# Altium schematic sheet Connectors.SchDoc
size A
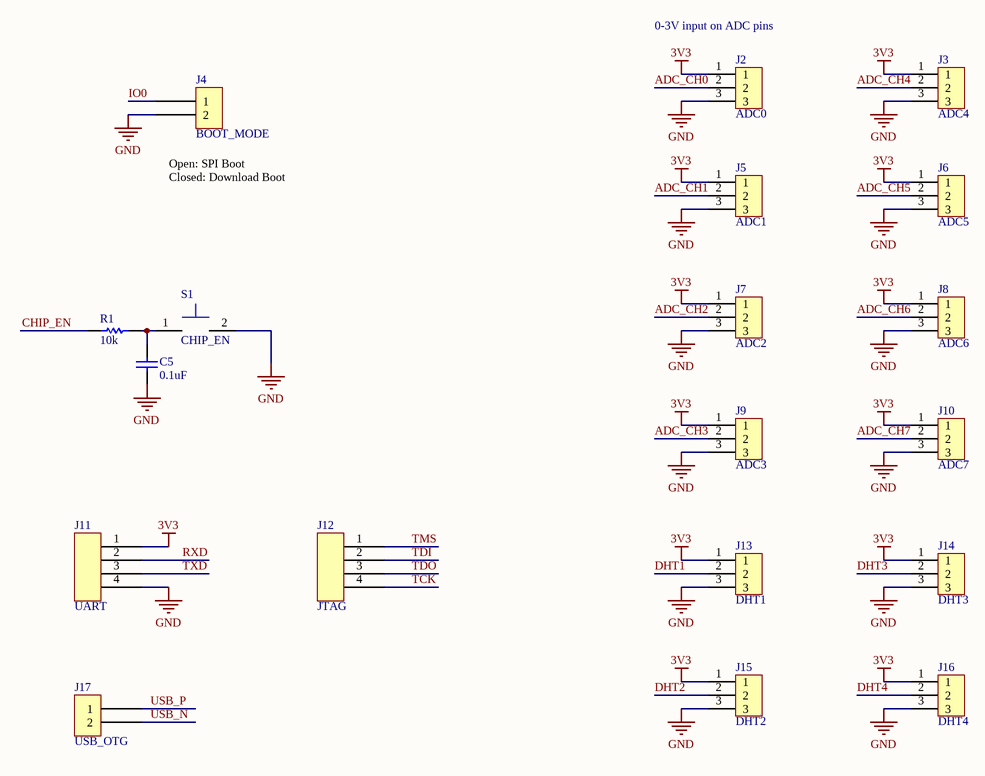
[diagram p0: Connectors.SchDoc]

## Parts
C5  0.1uF  [PCB-oygqt4xf3sesynjclq4r-1]
J2  ADC0  [PCB-xi9jnxfk0tsn3lp09zze-1]
J3  ADC4  [PCB-xi9jnxfk0tsn3lp09zze-1]
J4  BOOT_MODE  [Jumper]
J5  ADC1  [PCB-xi9jnxfk0tsn3lp09zze-1]
J6  ADC5  [PCB-xi9jnxfk0tsn3lp09zze-1]
J7  ADC2  [PCB-xi9jnxfk0tsn3lp09zze-1]
J8  ADC6  [PCB-xi9jnxfk0tsn3lp09zze-1]
J9  ADC3  [PCB-xi9jnxfk0tsn3lp09zze-1]
J10  ADC7  [PCB-xi9jnxfk0tsn3lp09zze-1]
J11  UART  [PCB-w7fgx0p37qyww1etoafk-1]
J12  JTAG  [PCB-w7fgx0p37qyww1etoafk-1]
J13  DHT1  [PCB-xi9jnxfk0tsn3lp09zze-1]
J14  DHT3  [PCB-xi9jnxfk0tsn3lp09zze-1]
J15  DHT2  [PCB-xi9jnxfk0tsn3lp09zze-1]
J16  DHT4  [PCB-xi9jnxfk0tsn3lp09zze-1]
J17  USB_OTG  [Jumper]
R1  10k  [PCB-urbe6pl2f36u5sj9z9e0-1]
S1  CHIP_EN  [PCB-xzcf6rj7v3ysitq80b7l-1]

## Nets
3V3: J2.1 J3.1 J5.1 J6.1 J7.1 J8.1 J9.1 J10.1 J11.1 J13.1 J14.1 J15.1 J16.1
GND: C5.1 J2.3 J3.3 J4.2 J5.3 J6.3 J7.3 J8.3 J9.3 J10.3 J11.4 J13.3 J14.3 J15.3 J16.3 S1.2
ADC_CH0: J2.2
ADC_CH1: J5.2
ADC_CH2: J7.2
ADC_CH3: J9.2
ADC_CH4: J3.2
ADC_CH5: J6.2
ADC_CH6: J8.2
ADC_CH7: J10.2
CHIP_EN: R1.2
DHT1: J13.2
DHT2: J15.2
DHT3: J14.2
DHT4: J16.2
IO0: J4.1
RXD: J11.2
TCK: J12.4
TDI: J12.2
TDO: J12.3
TMS: J12.1
TXD: J11.3
USB_N: J17.2
USB_P: J17.1
NetC5_2: C5.2 R1.1 S1.1

## Notes on the sheet
- (near J2) 0-3V input on ADC pins
- (near J4) Open: SPI Boot
  Closed: Download Boot

## Library data of the parts
C5 = CMP-2758844-5: 0.1uF, ±10%, 50V, X7R, 0805, Multilayer Ceramic Capacitor; Manufacturer Part Number: CL21B104KBCNNNC; Lead-Free Status: Lead Free; Voltage Rating (DC): 50.0 V; Capacitance: 100 nF; Operating Temperature: -55.0 °C (min); RoHS: Compliant; Octopart URL: https://octopart.com/cl21b104kbcnnnc-samsung-9299352; Mounting Style: Surface Mount; Case/Package: 0805; Dielectric Characteristic: X7R; OctopartID: 94265da154d84be1
J2 J3 J5-J10 J13-J16 = CMP-5821934eb82787e6-1: Conn Unshrouded Header HDR 3 POS 2.54mm Solder ST Thru-Hole; Manufacturer Part Number: 4-103321-5; ELV Compliant: Compliant; Mounting Style: PCB; RoHS: Compliant; Housing Color: Black; OctopartID: 5821934eb82787e6; Flammability Rating: UL 94 V-0; Contact Material: Phosphor Bronze; Octopart URL: http://octopart.com/4-103321-5-te+connectivity+%2F+amp-40224096; Contact Plating: Tin, Tin over Nickel; Housing Material: Thermoplastic; Lifecycle Status: Active; Orientation: Vertical
J4 J17 = CMP-08fac3900112d73d-14: 2 pin male header straight tht; Number of Positions: 2; Contact Plating: Gold; Mounting Style: Through Hole, Solder; Material: Thermoplastic
J11 J12 = CMP-4df18464dcf59236-2: Conn Unshrouded Header HDR 4 POS 2.54mm Solder ST Thru-Hole KK?? Bag; Manufacturer Part Number: 0022032041; RoHS: Compliant; Lifecycle Status: Not Listed by Manufacturer; Octopart URL: http://octopart.com/0022032041-molex-10466402; OctopartID: 4df18464dcf59236
R1 = CMP-1974d512ef63c6b3-1: Res, AEC-Q200, Thick Film, 10K, 5%, 0603; Manufacturer Part Number: CRGCQ0603J10K; Packaging: Cut Tape (CT); Resistance Tolerance: ±5%; Lifecycle Status: Not Listed by Manufacturer; OctopartID: 1974d512ef63c6b3; Octopart URL: https://octopart.com/crgcq0603j10k-te+connectivity-91018097
S1 = CMP-32abff024869ed6c-2: Switch Tactile Spst-No 0.02a 15v